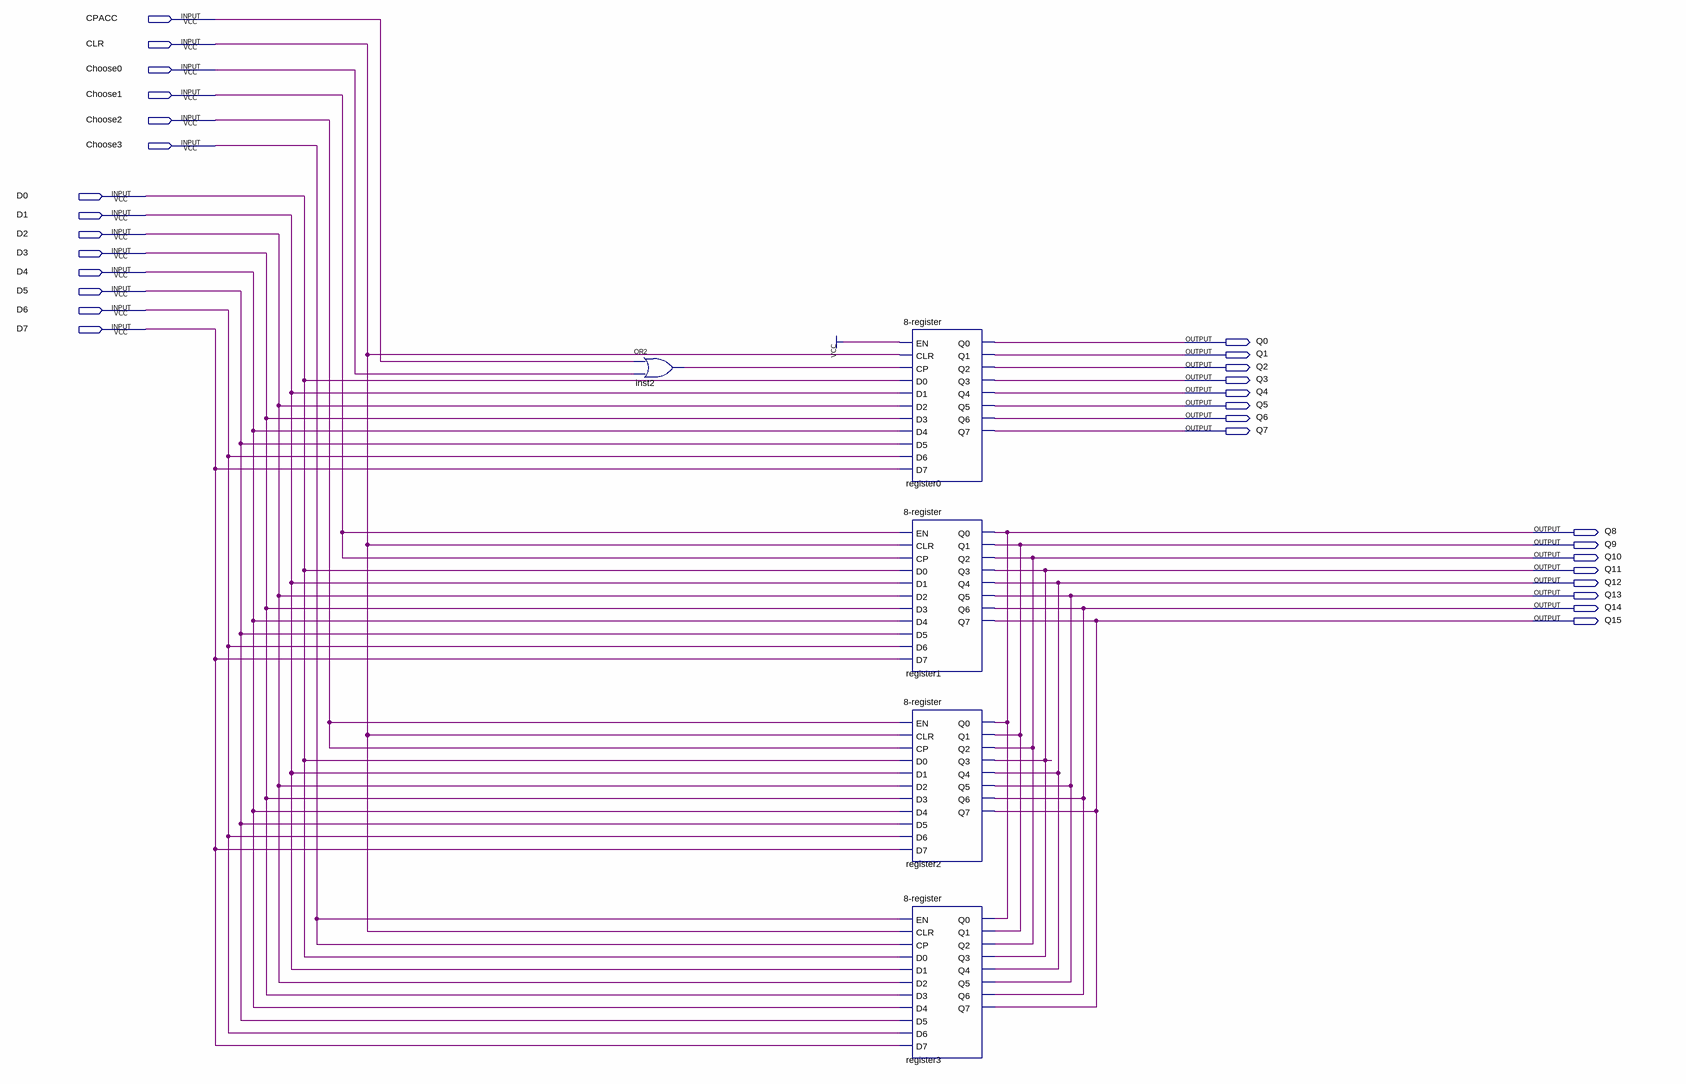
[diagram p0: schematic sheet]
// Quartus schematic 4-registers-group.bdf as structural Verilog: 5 symbols, 30 pins
module \4-registers-group  (
  input  CPACC,
  input  CLR,
  input  Choose0,
  input  Choose1,
  input  Choose2,
  input  Choose3,
  input  D0,
  input  D1,
  input  D2,
  input  D3,
  input  D4,
  input  D5,
  input  D6,
  input  D7,
  output Q0,
  output Q1,
  output Q2,
  output Q3,
  output Q4,
  output Q5,
  output Q6,
  output Q7,
  output Q8,
  output Q9,
  output Q10,
  output Q11,
  output Q12,
  output Q13,
  output Q14,
  output Q15
);

  wire inst2_out;

  or inst2 (inst2_out, CPACC, Choose0);
  \8-register  register0 (
    .EN(1'b1), .CLR(CLR), .CP(inst2_out), .D0(D0), .D1(D1), .D2(D2), .D3(D3), .D4(D4), .D5(D5), .D6(D6),
    .D7(D7), .Q0(Q0), .Q1(Q1), .Q2(Q2), .Q3(Q3), .Q4(Q4), .Q5(Q5), .Q6(Q6), .Q7(Q7));
  \8-register  register1 (
    .EN(Choose1), .CLR(CLR), .CP(Choose1), .D0(D0), .D1(D1), .D2(D2), .D3(D3), .D4(D4), .D5(D5), .D6(D6),
    .D7(D7), .Q0(Q8), .Q1(Q9), .Q2(Q10), .Q3(Q11), .Q4(Q12), .Q5(Q13), .Q6(Q14), .Q7(Q15));
  \8-register  register2 (
    .EN(Choose2), .CLR(CLR), .CP(Choose2), .D0(D0), .D1(D1), .D2(D2), .D3(D3), .D4(D4), .D5(D5), .D6(D6),
    .D7(D7), .Q0(Q8), .Q1(Q9), .Q2(Q10), .Q3(Q11), .Q4(Q12), .Q5(Q13), .Q6(Q14), .Q7(Q15));
  \8-register  register3 (
    .EN(Choose3), .CLR(CLR), .CP(Choose3), .D0(D0), .D1(D1), .D2(D2), .D3(D3), .D4(D4), .D5(D5), .D6(D6),
    .D7(D7), .Q0(Q8), .Q1(Q9), .Q2(Q10), .Q3(Q11), .Q4(Q12), .Q5(Q13), .Q6(Q14), .Q7(Q15));
endmodule
